# EAGLE design main1 (EAGLE 9.2.2)
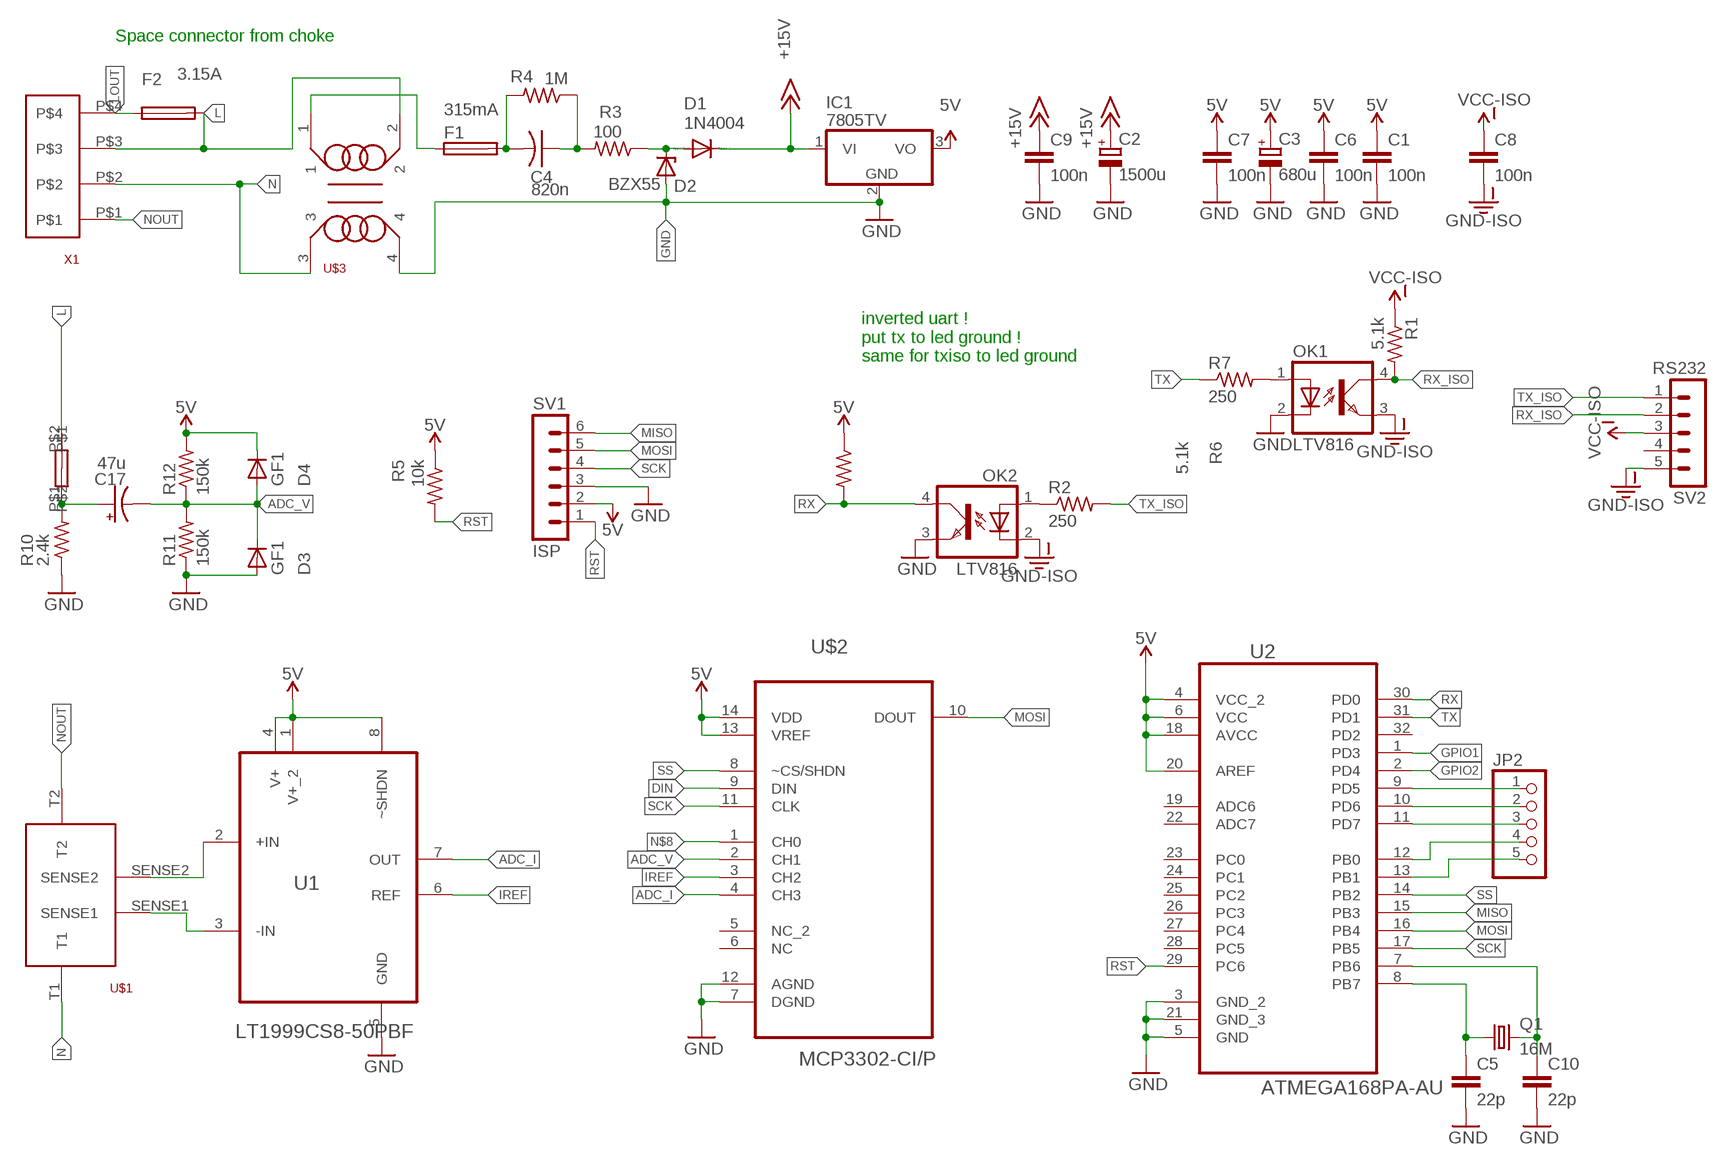
[diagram p0: schematic, sheet 1]

## Parts
C1  100n  C-EUC0603K  [C0603K]
C2  1500u  CPOL-EUE5-10.5  [E5-10,5]
C3  680u  CPOL-EUE3.5-8  [E3,5-8]
C4  820n  C-US225-087X268  [C225-087X268]
C5  22p  C-EUC0603  [C0603]
C6  100n  C-EUC0603K  [C0603K]
C7  100n  C-EUC0603K  [C0603K]
C8  100n  C-EUC0603  [C0603]
C9  100n  C-EUC0603K  [C0603K]
C10  22p  C-EUC0603  [C0603]
C17  47u  CPOL-USE5-6  [E5-6]
D1  1N4004  [DO41-10]
D2  BZX55  [DO35Z10]
D3  GF1  [SMA-DO214AC]
D4  GF1  [SMA-DO214AC]
F1  315mA  FUSESH22,5  [SH22,5]
F2  3.15A  FUSESH22,5  [SH22,5]
IC1  7805TV  [TO220V]
JP2  PINHD-1X5  [1X05]
OK1  LTV816  [DIL04]
OK2  LTV816  [DIL04]
Q1  16M  CRYSTALHC49U-V  [HC49U-V]
R1  5.1k  R-US_M0805  [M0805]
R2  250  R-US_M0805  [M0805]
R3  100  R-US_0411/15  [0411/15]
R4  1M  R-US_0617/17  [0617/17]
R5  10k  R-US_M0805  [M0805]
R6  5.1k  R-US_R0603  [R0603]
R7  250  R-US_R0603  [R0603]
R10  2.4k  R-US_0617/17  [0617/17]
R11  150k  R-US_M0805  [M0805]
R12  150k  R-US_M0805  [M0805]
R13  150k180k  RESISTOR_LONG  [RESISTOR_LONG]
SV1  ISP  MA06-1  [MA06-1]
SV2  RS232  MA05-1  [MA05-1]
U1  LT1999CS8-50PBF  [SOIC127P600X175-8N]
U2  ATMEGA168PA-AU  [QFP80P900X900X120-32N]
U$1  CSR2TTE30L0F  [CSR2TTE30L0F]
U$2  MCP3302-CI/P  [DIP254P762X533-14]
U$3  B302L_CM_CHOKE  [B302L_CM_CHOKE]
X1  SCREWTERM_5MM_4WAY  [SCREWTERM_5MM_4WAY]

## Nets
5V: C1.1 C3.+ C6.1 C7.1 D4.K(C) IC1.3(VO) R5.1 R6.1 R12.2 SV1.2 U1.1(V+_2) U1.4(V+) U1.8(~SHDN) U2.4(VCC_2) U2.6(VCC) U2.18(AVCC) U2.20(AREF) U$2.13(VREF) U$2.14(VDD)
+15V: C2.+ C9.1 D1.C IC1.1(VI)
ADC_I: U1.7(OUT) U$2.4(CH3)
ADC_V: C17.- D3.K(C) D4.A R11.2 R12.1 U$2.2(CH1)
DIN: U$2.9(DIN)
GND: C1.2 C2.- C3.- C5.2 C6.2 C7.2 C9.2 C10.2 D2.A D3.A IC1.2(GND) OK1.2(C) OK2.3(EMIT) R10.1 R11.1 SV1.3 U1.5(GND) U2.3(GND_2) U2.5(GND) U2.21(GND_3) U$2.7(DGND) U$2.12(AGND) U$3.4
GND-ISO: C8.2 OK1.3(EMIT) OK2.2(C) SV2.5
GPIO1: U2.1(PD3)
GPIO2: U2.2(PD4)
IREF: U1.6(REF) U$2.3(CH2)
L: F2.2 R13.P$2 U$3.2 X1.P$3
LOUT: F2.1 X1.P$4
MISO: SV1.6 U2.15(PB3)
MOSI: SV1.5 U2.16(PB4) U$2.10(DOUT)
N: U$1.T1 U$3.3 X1.P$2
N$1: C4.1 R3.2 R4.1
N$2: C4.2 F1.2 R4.2
N$3: D1.A D2.C R3.1
N$4: U1.2(+IN) U$1.SENSE2
N$5: U1.3(-IN) U$1.SENSE1
N$6: F1.1 U$3.1
N$7: OK1.1(A) R7.2
N$8: U$2.1(CH0)
N$10: C5.1 Q1.1 U2.8(PB7)
N$11: C10.1 Q1.2 U2.7(PB6)
N$12: OK2.1(A) R2.1
N$13: JP2.1 U2.9(PD5)
N$14: JP2.2 U2.10(PD6)
N$15: JP2.3 U2.11(PD7)
N$16: JP2.4 U2.12(PB0)
N$17: JP2.5 U2.13(PB1)
N$20: C17.+ R10.2 R13.P$1
NOUT: U$1.T2 X1.P$1
RST: R5.2 SV1.1 U2.29(PC6)
RX: OK2.4(COL) R6.2 U2.30(PD0)
RX_ISO: OK1.4(COL) R1.2 SV2.2
SCK: SV1.4 U2.17(PB5) U$2.11(CLK)
SS: U2.14(PB2) U$2.8(~CS/SHDN)
TX: R7.1 U2.31(PD1)
TX_ISO: R2.2 SV2.1
VCC-ISO: C8.1 R1.1 SV2.3
Unconnected: SV2.4 U2.19(ADC6) U2.22(ADC7) U2.23(PC0) U2.24(PC1) U2.25(PC2) U2.26(PC3) U2.27(PC4) U2.28(PC5) U2.32(PD2) U$2.5(NC_2) U$2.6(NC)

## Notes on the sheet
- Space connector from choke
- inverted uart !
  put tx to led ground !
  same for txiso to led ground

## Library data of the parts
C1 C5-C10 = rcl:C-EU: CAPACITOR, European symbol
C2 C3 = rcl:CPOL-EU: POLARIZED CAPACITOR, European symbol
C4 = adafruit:C-US: CAPACITOR, American symbol
C17 = adafruit:CPOL-US: POLARIZED CAPACITOR, American symbol
D1 = diode:1N4004: DIODE general purpose rectifier, 1 A
D2 = diode:BZX55: Z DIODE
D3 D4 = diode:GF1: DIODE
F1 F2 = fuse:FUSE: Fuse; OC_FARNELL: unknown; OC_NEWARK: unknown
IC1 = linear:78*: Positive VOLTAGE REGULATOR Source: http://cache.national.com/ds/LM/LM78L05.pdf http://www.fairchildsemi.com/ds/LM/LM7805.pdf
JP2 = pinhead:PINHD-1X5: PIN HEADER
OK1 OK2 = optocoupler:LTV816: OPTO COUPLER Source: LITEON, LTV816.pdf; OC_FARNELL: unknown; OC_NEWARK: unknown
Q1 = crystal:CRYSTAL: CRYSTAL; OC_FARNELL: 1666969; OC_NEWARK: unknown
R1-R7 R10-R12 = adafruit:R-US_: RESISTOR, American symbol
R13 = 7_segment_lib:RESISTOR_LONG
SV1 = con-lstb:MA06-1: PIN HEADER; OC_FARNELL: unknown; OC_NEWARK: unknown
SV2 = con-lstb:MA05-1: PIN HEADER; OC_FARNELL: unknown; OC_NEWARK: unknown
U1 = LTC_By_element14_Batch_1:LT1999CS8-50PBF: High Voltage, Bidirectional Current Sense Amplifier; MPN: LT1999CS8-50#PBF; OC_FARNELL: 1868097; OC_NEWARK: 24T0472; PACKAGE: SOIC-8; SUPPLIER: LINEAR TECHNOLOGY
U2 = Atmel_By_element14_Batch_1-00:ATMEGA168PA-AU: 8-bit Microcontroller; MPN: ATMEGA168PA-AU; OC_FARNELL: 1748516; OC_NEWARK: 26R5629; PACKAGE: TQFP-32; SUPPLIER: Atmel
U$1 = 7_segment_lib:CSR2TTE30L0F; SPICEPREFIX: E
U$2 = Microchip_By_element14_Batch_1:MCP3302-CI/P: A/D Converter; MPN: MCP3302-CI/P; OC_FARNELL: 1439393; OC_NEWARK: 69K7606; PACKAGE: DIP-14; SUPPLIER: Microchip
U$3 = 7_segment_lib:B302L_CM_CHOKE
X1 = 7_segment_lib:SCREWTERM_5MM_4WAY

## Board
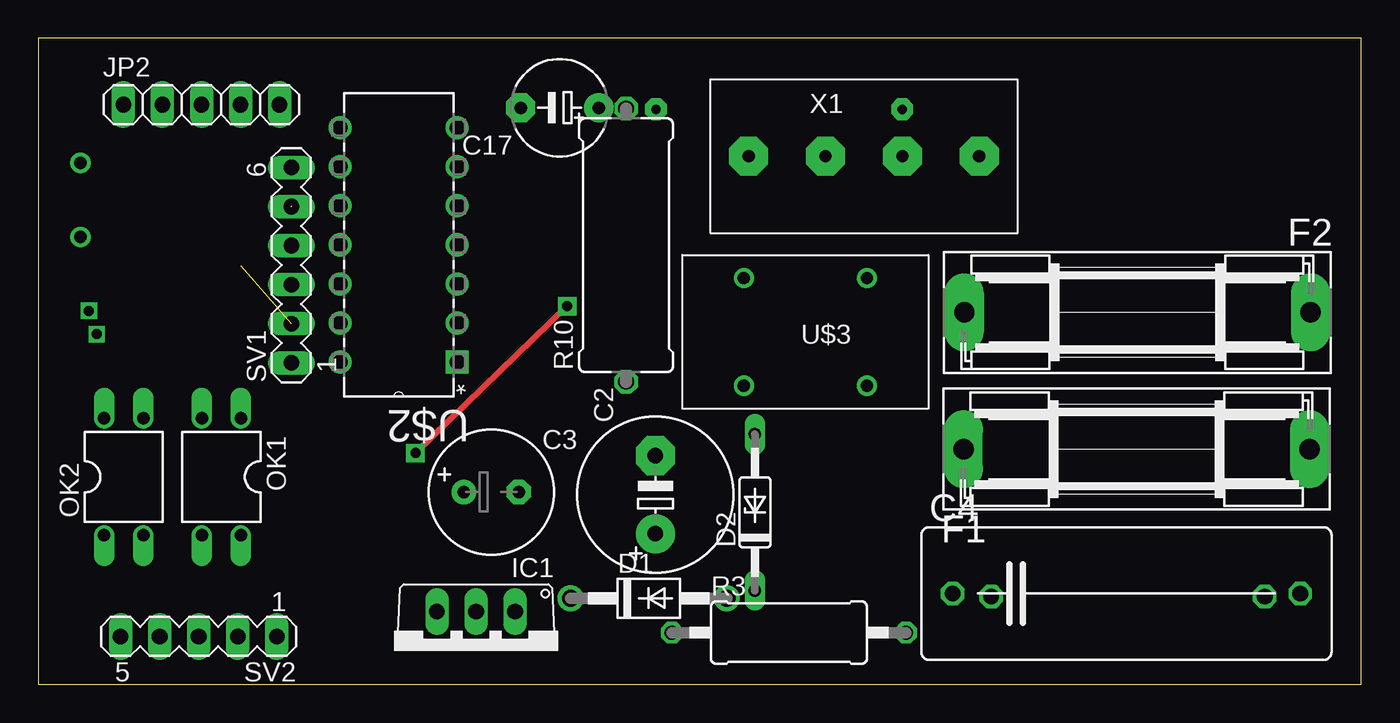
[diagram p1: board, top side]
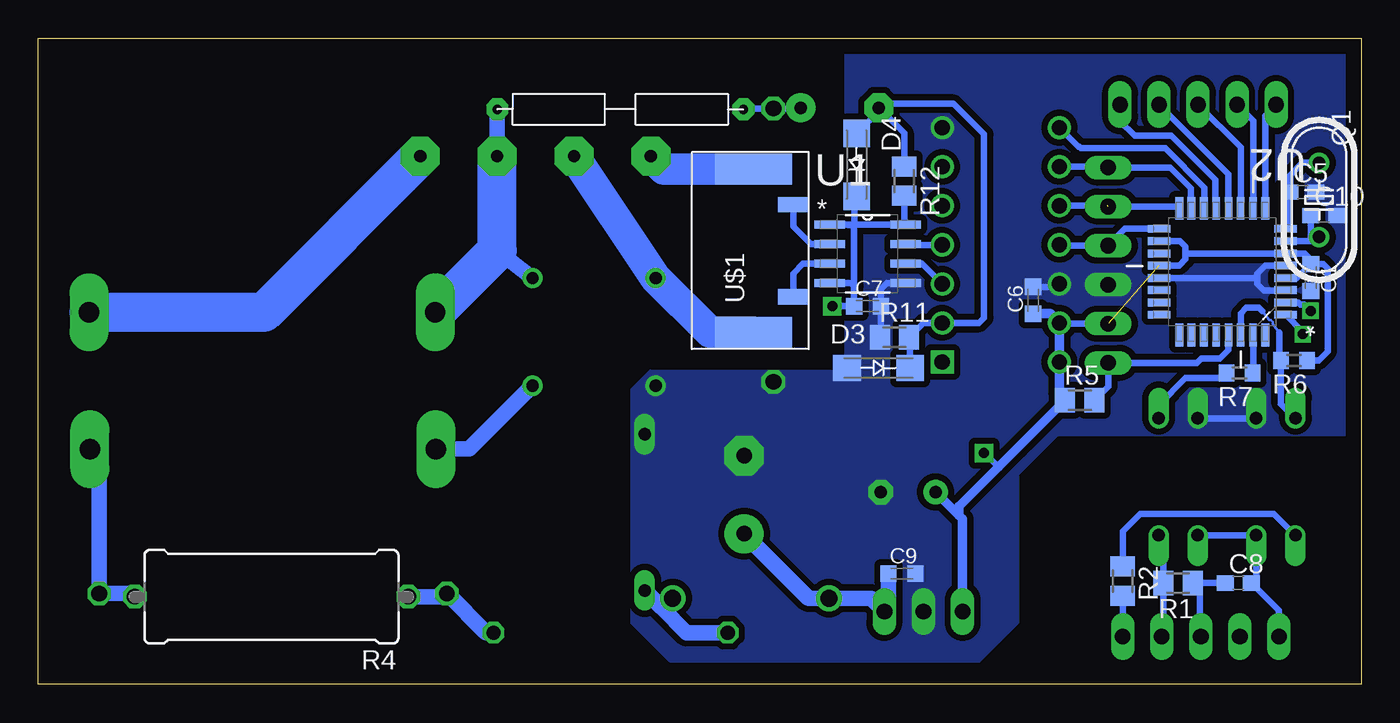
[diagram p2: board, bottom side, seen from below]

Size 86 x 42 mm. Coordinates in mm from the lower left corner, seen from the top.
Outline: 0,0 86,0 86,42 0,42 0,0
Copper layers (1*16): Top 0.035mm / dielectric 1.5mm / Bottom 0.035mm
Design rules "default": minimum track width 6mil, minimum drill 0.35mm, track to track 6mil, track to pad 6mil, pad to pad 6mil, via to via 6mil, smd to smd 6mil, copper to edge 40mil, drill to drill 6mil, minimum pad ring 10mil, minimum via ring 8mil, stop-mask expansion 4mil, vias tented up to drill 0mil, thermal gap 10mil

### Footprints (pad centres in the part's own frame; a part is rotated, then mirrored left to right if it is on the bottom)
C0603K = smd 1.05 x 1.08: 1 -0.875,0; 2 0.875,0
E5-10,5 = drill 1.016 pad 2.54: + -2.54,0 | drill 1.016 pad 2.54 octagon: - 2.54,0
E3,5-8 = drill 0.813 pad 1.6: + -1.778,0 | drill 0.813 pad 1.6 octagon: - 1.778,0
C225-087X268 = drill 1.016 octagon: 1 -11.303,0; 2 11.303,0
C0603 = smd 1.1 x 1: 1 -0.85,0; 2 0.85,0
E5-6 = drill 0.813 pad 1.905: + -2.54,0 | drill 0.813 pad 1.905 octagon: - 2.54,0
DO41-10 = drill 1.118: A 5.08,0; C -5.08,0
DO35Z10 = drill 0.813 long: A 5.08,0; C -5.08,0
SMA-DO214AC = smd 1.8 x 1.7: A -2.05,0; K 2.05,0
SH22,5 = drill 1.321 pad 2.54 long: 1 -11.252,0; 2 11.252,0
TO220V = drill 1.016 long: 1 -2.54,-2.54; 2 0,-2.54; 3 2.54,-2.54
1X05 = drill 1.016 long: 1 -5.08,0; 2 -2.54,0; 3 0,0; 4 2.54,0; 5 5.08,0
DIL04 = drill 0.813 offset: 1 -1.27,-3.81; 2 1.27,-3.81; 3 1.27,3.81; 4 -1.27,3.81
HC49U-V = drill 0.813: 1 -2.413,0; 2 2.413,0
M0805 = smd 1.3 x 1.6: 1 -0.95,0; 2 0.95,0
0411/15 = drill 0.914 octagon: 1 -7.62,0; 2 7.62,0
0617/17 = drill 1.016 octagon: 1 -8.89,0; 2 8.89,0
R0603 = smd 1 x 1.1: 1 -0.85,0; 2 0.85,0
RESISTOR_LONG = drill 0.6 pad 1.422 octagon: P$1 0,0; P$2 16,0
MA06-1 = drill 1.016 long: 1 -6.35,0; 2 -3.81,0; 3 -1.27,0; 4 1.27,0; 5 3.81,0; 6 6.35,0
MA05-1 = drill 1.016 long: 1 -5.08,0; 2 -2.54,0; 3 0,0; 4 2.54,0; 5 5.08,0
SOIC127P600X175-8N = smd 1.981 x 0.533: 1 -2.464,1.905; 2 -2.464,0.635; 3 -2.464,-0.635; 4 -2.464,-1.905; 5 2.464,-1.905; 6 2.464,-0.635; 7 2.464,0.635; 8 2.464,1.905
QFP80P900X900X120-32N = smd 1.473 x 0.508: 1 -4.115,2.794; 2 -4.115,2.007; 3 -4.115,1.194; 4 -4.115,0.406; 5 -4.115,-0.406; 6 -4.115,-1.194; 7 -4.115,-2.007; 8 -4.115,-2.794; 17 4.115,-2.794; 18 4.115,-2.007; 19 4.115,-1.194; 20 4.115,-0.406; 21 4.115,0.406; 22 4.115,1.194; 23 4.115,2.007; 24 4.115,2.794 | smd 0.508 x 1.473: 9 -2.794,-4.115; 10 -2.007,-4.115; 11 -1.194,-4.115; 12 -0.406,-4.115; 13 0.406,-4.115; 14 1.194,-4.115; 15 2.007,-4.115; 16 2.794,-4.115; 25 2.794,4.115; 26 2.007,4.115; 27 1.194,4.115; 28 0.406,4.115; 29 -0.406,4.115; 30 -1.194,4.115; 31 -2.007,4.115; 32 -2.794,4.115
CSR2TTE30L0F = smd 1 x 2: SENSE1 -2.8,-2.8; SENSE2 3.2,-2.8 | smd 2 x 5: T1 -5.1,-0.2; T2 5.5,-0.2
DIP254P762X533-14 = drill 0.991 square: 1 -7.62,15.24 | drill 0.991: 2 -7.62,12.7; 3 -7.62,10.16; 4 -7.62,7.62; 5 -7.62,5.08; 6 -7.62,2.54; 7 -7.62,0; 8 0,0; 9 0,2.54; 10 0,5.08; 11 0,7.62; 12 0,10.16; 13 0,12.7; 14 0,15.24
B302L_CM_CHOKE = drill 0.8: 1 -4,3.5; 2 -4,-3.5; 3 4,-3.5; 4 4,3.5
SCREWTERM_5MM_4WAY = drill 0.8 pad 2.54 octagon: P$1 -7.5,0; P$2 -2.5,0; P$3 2.5,0; P$4 7.5,0

### Placement (x,y rotation side)
C1  3.27,26.45 270 bottom
C2  40.11,12.32 90 top
C3  29.45,12.5 0 top
C4  70.75,5.89 0 top
C5  3.79,32 0 bottom
C6  21.32,24.97 90 bottom
C7  32.09,24.59 0 bottom
C8  7.98,6.58 0 bottom
C9  29.85,7.19 0 bottom
C10  2.42,30.48 0 bottom
C17  33.89,37.49 180 top
D1  39.68,5.59 0 top
D2  46.59,11.18 90 top
D3  31.38,20.57 0 bottom
D4  32.8,33.78 270 bottom
F1  71.41,15.29 0 top
F2  71.46,24.18 180 top
IC1  28.45,2.18 180 top
JP2  10.6,37.69 0 top
OK1  11.89,13.49 180 top
OK2  5.54,13.49 0 top
Q1  2.72,31.5 270 bottom
R1  11.89,6.58 180 bottom
R2  15.5,6.71 270 bottom
R3  48.8,3.35 0 top
R4  70.85,5.69 180 bottom
R5  18.29,18.47 0 bottom
R6  4.35,21.06 180 bottom
R7  7.91,20.24 180 bottom
R10  38.21,28.55 90 top
R11  30.33,22.56 0 bottom
R12  29.7,32.72 270 bottom
R13  40.16,37.39 180 bottom
SV1  16.44,27.25 90 top
SV2  10.42,3.1 180 top
U1  32.09,27.99 0 bottom
U2  9.02,26.82 180 bottom
U$1  39.71,27.99 90 bottom
U$2  19.62,36.2 180 top
U$3  49.87,22.91 180 top
X1  53.68,34.34 0 top

### Tracks (layer width: path | path; a pad name or v marks a point on that pad's centre or on a via)
5V  (via drill 0.65 pad 1.2)  (1 unrouted)
  Top 0.406: v34.37,24.59 v24.52,15.04
  Bottom 0.406: 32.96,25.91 C7.1 v34.37,24.59 | 32.96,25.91 32.96,29.86 | 32.96,29.86 32.95,29.87 32.95,31.58 D4.K | U1.4 33.14,26.09 32.96,25.91 | 33.36,29.9 U1.1 | 33.36,29.9 U1.8 29.7,29.97 R12.2 | 32.96,29.86 33.32,29.86 33.36,29.9 | U2.18 11.79,28.83 11.41,28.45 11.41,28.04 | 11.41,28.04 11.41,27.64 11.82,27.23 U2.20 | 11.41,28.04 11.39,28.02 U2.6 3.66,28.02 3.27,27.62 C1.1 | C1.1 4.18,26.42 U2.4 | SV1.2 19.59,23.44 19.61,23.47 | v24.52,15.04 23.6,14.11 | R6.1 2.75,21.06 2.17,21.64 2.17,27.03 2.47,27.33 C1.1
  Bottom 0.61: C6.1 20.21,24.09 U$2.13 19.61,23.47 U$2.14 19.61,18.84 R5.1 23.6,14.11 26.14,11.57 26.14,10.97 | 26.14,10.97 C3.+ | 26.14,10.97 25.91,10.74 IC1.3
+15V
  Bottom 1.016: C2.+ 35.92,5.59 D1.C 31.86,5.59 IC1.1 30.73,4.99 C9.1
ADC_I
  Bottom 0.406: U$2.4 29.57,28.57 U1.7
ADC_V
  Bottom 0.406: 31.26,37.4 29.7,35.84 R12.1 | 31.26,37.4 C17.- | 31.26,37.37 D4.A | 31.26,37.37 31.26,37.4 | D3.K 29.33,22.5 R11.2 28.44,23.49 U$2.2 24.85,23.49 24.52,23.83 24.52,35.76 26.5,37.74 30.89,37.74 31.26,37.37
DIN
  Bottom 0.406: U$2.9 16.49,33.65
GND
  Bottom 0.406: OK1.2 OK2.3 | U2.5 6.23,27.23 6.74,26.72 6.74,26.42 | 6.74,26.42 6.74,26.01 6.33,25.6 4.93,25.6 U2.3 | 6.74,26.42 U2.21 | C6.2 19.81,25.84 U$2.12 | U1.5 30.84,26.09 31.22,25.7 31.22,24.6 | 31.22,24.6 C7.2 | R11.1 31.22,22.62 31.22,24.6
  pour Bottom (isolate 0.406, no thermals): 31.02,44.7 -0.48,44.7 -3.02,42.16 -3.02,18.69 -0.48,16.15 19.74,16.15 22.28,13.61 22.28,3.96 24.82,1.42 44.94,1.42 47.48,3.96 47.48,19.21 46.2,20.48 33.56,20.42 33.56,42.16
GND-ISO
  Bottom 0.406: SV2.5 5.34,4.79 C8.2 6.81,6.9 OK2.2 OK1.3
GPIO1  (via drill 0.65 pad 1)
  Bottom 0.406: U2.1 3.79,22.91 v3.79,22.76
GPIO2  (via drill 0.65 pad 1)
  Bottom 0.406: U2.2 4.08,24.82 3.96,24.69 3.69,24.69 v3.28,24.28
IREF
  Bottom 0.406: U1.6 28.56,27.36 U$2.3
L
  Bottom 1.016: 56.16,34.35 X1.P$3 56.18,37.38 R13.P$2 | U$3.2 56.18,28.21
  Bottom 2.54: X1.P$3 56.18,28.21 F2.2
LOUT
  Bottom 2.54: X1.P$4 71.34,24.18 F2.1
MISO
  Bottom 0.406: U2.15 11.06,30.96 11.06,32.26 12.4,33.6 SV1.6
MOSI  (1 unrouted)
  Bottom 0.406: U$2.10 16.49,31.11 | U2.16 11.95,31.06 SV1.5
N
  Bottom 2.032: U$1.T1 42.35,22.89 U$3.3 X1.P$2
N$1
  Bottom 1.016: R3.2 56.9,3.35 C4.1 59.65,5.69 R4.1
N$2
  Bottom 1.016: F1.2 82.05,14.68 C4.2 79.94,5.89 R4.2
N$3
  Bottom 1.016: R3.1 43.85,3.35 45.46,4.97 | 45.46,4.97 D2.C | D1.A 44.84,5.59 45.46,4.97
N$4
  Bottom 0.406: U1.2 35.77,28.63 36.91,29.77 U$1.SENSE2
N$5
  Bottom 0.406: U1.3 36.28,27.36 36.91,26.72 U$1.SENSE1
N$6
  Bottom 1.016: F1.1 57.99,15.29 U$3.1
N$7
  Bottom 0.406: R7.2 9.09,19.91 11.41,19.91 13.16,18.16 OK1.1
N$10
  Bottom 0.406: Q1.1 3.82,33.91 4.6,33.12 4.6,32.04 C5.1 4.64,29.88 U2.8
N$11
  Bottom 0.406: 2.98,28.83 U2.7 | 2.98,28.83 Q1.2 | C10.1 3.27,29.12 2.98,28.83
N$12
  Bottom 0.406: OK2.1 5.67,11.07 14.36,11.07 15.5,9.93 R2.1
N$13
  Bottom 0.406: JP2.1 6.23,36.98 U2.9
N$14
  Bottom 0.406: JP2.2 7.02,36.65 U2.10
N$15
  Bottom 0.406: JP2.3 7.83,34.92 U2.11
N$16
  Bottom 0.406: JP2.4 8.62,33.17 U2.12
N$17
  Bottom 0.406: JP2.5 15.68,36.63 14.71,35.66 12.33,35.66 9.48,32.82 9.48,30.99 U2.13
N$20
  Bottom 0.406: C17.+ 36.48,37.44 R10.2 40.11,37.44 R13.P$1
NOUT
  Bottom 2.032: X1.P$1 45.33,33.49 U$1.T2
RST
  Bottom 0.406: U2.29 8.62,21.74 9.18,21.18 10.4,21.18 10.68,20.9 SV1.1 16.44,19.37 R5.2
RX
  Bottom 0.152: 6.43,24.28 5.95,23.67 5.88,23.67 5.75,23.54 5.75,23.41 5.31,22.86
  Bottom 0.406: OK2.4 5.2,18.23 R6.2 5.31,21.17 5.31,22.86 | U2.30 7.83,24.1 7.45,24.49 6.64,24.49 6.43,24.28
RX_ISO
  Bottom 0.406: OK1.4 arc90 12.84,9.36 R1.2 12.84,3.22 SV2.2
SCK
  Bottom 0.406: U2.17 15.35,29.62 SV1.4 19.56,28.52 U$2.11
SS
  Bottom 0.406: U$2.8 18.37,34.95 18.32,34.95 18.22,34.85 12.73,34.85 10.19,32.31 10.19,30.96 U2.14
TX
  Bottom 0.406: R7.1 7.02,20.28 U2.31
TX_ISO
  Bottom 0.406: SV2.1 R2.2
VCC-ISO
  Bottom 0.406: 10.5,6.58 R1.1 | 10.5,6.58 C8.1 | SV2.3 arc90 10.5,3.17 10.5,6.58